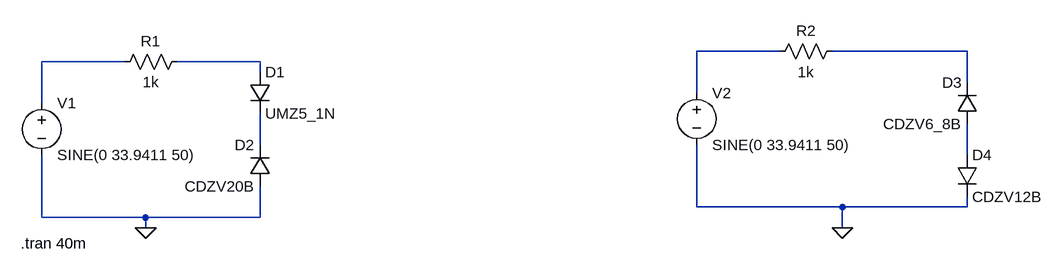
[diagram p0: schematic recortadores.asc]
recortadores.asc, the LTspice schematic file:
Version 4.1
SHEET 1 1224 680
WIRE 816 64 688 64
WIRE 1104 64 896 64
WIRE -192 80 -320 80
WIRE 16 80 -112 80
WIRE 16 96 16 80
WIRE 1104 112 1104 64
WIRE 688 128 688 64
WIRE -320 144 -320 80
WIRE 16 208 16 160
WIRE 1104 224 1104 176
WIRE 688 304 688 208
WIRE 912 304 688 304
WIRE 1104 304 1104 288
WIRE 1104 304 912 304
WIRE -320 320 -320 224
WIRE -160 320 -320 320
WIRE 16 320 16 272
WIRE 16 320 -160 320
WIRE -160 336 -160 320
WIRE 912 336 912 304
FLAG -160 336 0
FLAG 912 336 0
SYMBOL diode 0 96 R0
SYMATTR InstName D1
SYMATTR Value UMZ5_1N
SYMATTR Description Diode
SYMATTR Type diode
SYMBOL diode 32 272 R180
WINDOW 0 24 64 Left 2
WINDOW 3 24 0 Left 2
SYMATTR InstName D2
SYMATTR Value CDZV20B
SYMATTR Description Diode
SYMATTR Type diode
SYMBOL diode 1120 176 R180
WINDOW 0 24 64 Left 2
WINDOW 3 24 0 Left 2
SYMATTR InstName D3
SYMATTR Value CDZV6_8B
SYMATTR Description Diode
SYMATTR Type diode
SYMBOL diode 1088 224 R0
SYMATTR InstName D4
SYMATTR Value CDZV12B
SYMATTR Description Diode
SYMATTR Type diode
SYMBOL voltage -320 128 R0
WINDOW 123 0 0 Left 0
WINDOW 39 0 0 Left 0
SYMATTR InstName V1
SYMATTR Value SINE(0 33.9411 50)
SYMBOL res -96 64 R90
WINDOW 0 0 56 VBottom 2
WINDOW 3 32 56 VTop 2
SYMATTR InstName R1
SYMATTR Value 1k
SYMBOL voltage 688 112 R0
WINDOW 123 0 0 Left 0
WINDOW 39 0 0 Left 0
SYMATTR InstName V2
SYMATTR Value SINE(0 33.9411 50)
SYMBOL res 912 48 R90
WINDOW 0 0 56 VBottom 2
WINDOW 3 32 56 VTop 2
SYMATTR InstName R2
SYMATTR Value 1k
TEXT -352 360 Left 2 !.tran 40m

The netlist it stands for:
* recortadores.asc
D1 N004 N005 UMZ5_1N
D2 0 N005 CDZV20B
D3 N006 N002 CDZV6_8B
D4 N006 0 CDZV12B
V1 N003 0 SINE(0 33.9411 50)
R1 N004 N003 1k
V2 N001 0 SINE(0 33.9411 50)
R2 N002 N001 1k
.model D D
.lib standard.dio
.tran 40m
.backanno
.end